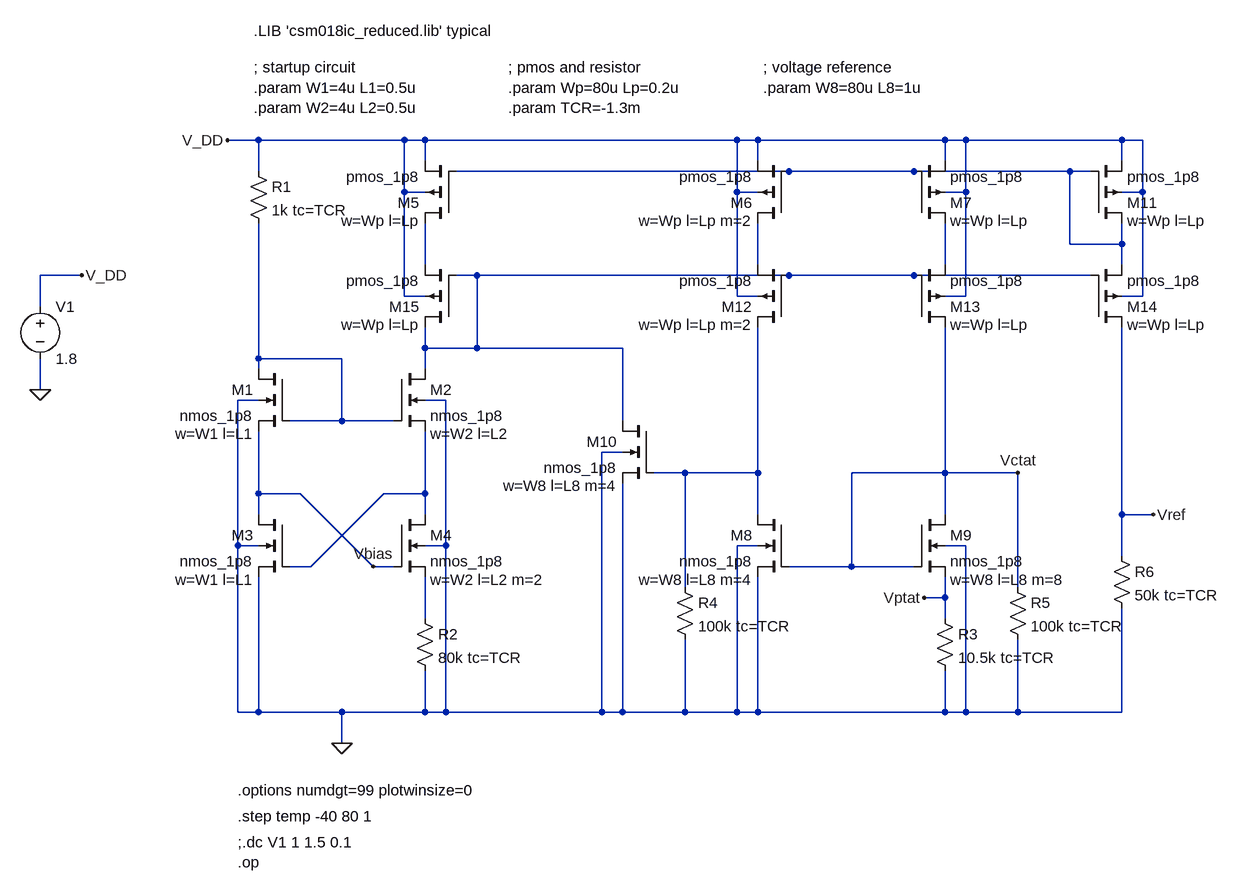
[diagram p0: schematic voltage_ref_cascode.asc]
voltage_ref_cascode.asc, the LTspice schematic file:
Version 4
SHEET 1 2776 948
WIRE 144 -176 96 -176
WIRE 368 -176 144 -176
WIRE 400 -176 368 -176
WIRE 880 -176 400 -176
WIRE 912 -176 880 -176
WIRE 1200 -176 912 -176
WIRE 1232 -176 1200 -176
WIRE 1472 -176 1232 -176
WIRE 1504 -176 1472 -176
WIRE 400 -144 400 -176
WIRE 912 -144 912 -176
WIRE 1200 -144 1200 -176
WIRE 1472 -144 1472 -176
WIRE 144 -128 144 -176
WIRE 960 -128 448 -128
WIRE 1152 -128 960 -128
WIRE 1392 -128 1152 -128
WIRE 1424 -128 1392 -128
WIRE 368 -96 368 -176
WIRE 400 -96 368 -96
WIRE 880 -96 880 -176
WIRE 912 -96 880 -96
WIRE 1232 -96 1232 -176
WIRE 1232 -96 1200 -96
WIRE 1504 -96 1504 -176
WIRE 1504 -96 1472 -96
WIRE 1392 -16 1392 -128
WIRE 1472 -16 1472 -48
WIRE 1472 -16 1392 -16
WIRE 400 16 400 -48
WIRE 912 16 912 -48
WIRE 1200 16 1200 -48
WIRE 1472 16 1472 -16
WIRE -128 32 -192 32
WIRE 480 32 448 32
WIRE 960 32 480 32
WIRE 1152 32 960 32
WIRE 1424 32 1152 32
WIRE 368 64 368 -96
WIRE 400 64 368 64
WIRE 880 64 880 -96
WIRE 912 64 880 64
WIRE 1232 64 1232 -96
WIRE 1232 64 1200 64
WIRE 1504 64 1504 -96
WIRE 1504 64 1472 64
WIRE -192 80 -192 32
WIRE 400 144 400 112
WIRE 480 144 480 32
WIRE 480 144 400 144
WIRE 704 144 480 144
WIRE 144 160 144 -48
WIRE 272 160 144 160
WIRE 144 176 144 160
WIRE 400 176 400 144
WIRE -192 208 -192 160
WIRE 144 224 112 224
WIRE 432 224 400 224
WIRE 272 256 272 160
WIRE 272 256 192 256
WIRE 352 256 272 256
WIRE 704 256 704 144
WIRE 704 304 672 304
WIRE 800 336 752 336
WIRE 912 336 912 112
WIRE 912 336 800 336
WIRE 1200 336 1200 112
WIRE 1200 336 1056 336
WIRE 1312 336 1200 336
WIRE 144 368 144 272
WIRE 208 368 144 368
WIRE 400 368 400 272
WIRE 400 368 336 368
WIRE 144 400 144 368
WIRE 400 400 400 368
WIRE 912 400 912 336
WIRE 1200 400 1200 336
WIRE 1472 400 1472 112
WIRE 1520 400 1472 400
WIRE 112 448 112 224
WIRE 144 448 112 448
WIRE 432 448 432 224
WIRE 432 448 400 448
WIRE 912 448 880 448
WIRE 1232 448 1200 448
WIRE 1472 464 1472 400
WIRE 224 480 336 368
WIRE 224 480 192 480
WIRE 320 480 208 368
WIRE 352 480 320 480
WIRE 1056 480 1056 336
WIRE 1056 480 960 480
WIRE 1152 480 1056 480
WIRE 800 512 800 336
WIRE 1312 512 1312 336
WIRE 1200 528 1200 496
WIRE 1200 528 1168 528
WIRE 400 560 400 496
WIRE 1200 560 1200 528
WIRE 112 704 112 448
WIRE 144 704 144 496
WIRE 144 704 112 704
WIRE 272 704 144 704
WIRE 400 704 400 640
WIRE 400 704 272 704
WIRE 432 704 432 448
WIRE 432 704 400 704
WIRE 672 704 672 304
WIRE 672 704 432 704
WIRE 704 704 704 352
WIRE 704 704 672 704
WIRE 800 704 800 592
WIRE 800 704 704 704
WIRE 880 704 880 448
WIRE 880 704 800 704
WIRE 912 704 912 496
WIRE 912 704 880 704
WIRE 1200 704 1200 640
WIRE 1200 704 912 704
WIRE 1232 704 1232 448
WIRE 1232 704 1200 704
WIRE 1312 704 1312 592
WIRE 1312 704 1232 704
WIRE 1472 704 1472 544
WIRE 1472 704 1312 704
WIRE 272 752 272 704
FLAG 96 -176 V_DD
FLAG -192 208 0
FLAG -128 32 V_DD
FLAG 272 752 0
FLAG 1168 528 Vptat
FLAG 1312 336 Vctat
FLAG 1520 400 Vref
FLAG 320 480 Vbias
SYMBOL nmos4 192 176 M0
WINDOW 123 56 100 Left 2
SYMATTR Value2 w=W1 l=L1
SYMATTR InstName M1
SYMATTR Value nmos_1p8
SYMBOL nmos4 192 400 M0
WINDOW 123 56 100 Left 2
SYMATTR Value2 w=W1 l=L1
SYMATTR InstName M3
SYMATTR Value nmos_1p8
SYMBOL nmos4 352 176 R0
WINDOW 123 56 100 Left 2
SYMATTR Value2 w=W2 l=L2
SYMATTR InstName M2
SYMATTR Value nmos_1p8
SYMBOL nmos4 352 400 R0
WINDOW 123 56 100 Left 2
SYMATTR Value2 w=W2 l=L2 m=2
SYMATTR InstName M4
SYMATTR Value nmos_1p8
SYMBOL res 128 -144 R0
SYMATTR InstName R1
SYMATTR Value 1k tc=TCR
SYMBOL res 384 544 R0
SYMATTR InstName R2
SYMATTR Value 80k tc=TCR
SYMBOL voltage -192 64 R0
WINDOW 123 0 0 Left 0
WINDOW 39 0 0 Left 0
SYMATTR InstName V1
SYMATTR Value 1.8
SYMBOL pmos4 960 -48 R180
WINDOW 123 56 4 Left 2
SYMATTR Value2 w=Wp l=Lp m=2
SYMATTR InstName M6
SYMATTR Value pmos_1p8
SYMBOL pmos4 1152 -48 M180
WINDOW 123 56 4 Left 2
SYMATTR Value2 w=Wp l=Lp
SYMATTR InstName M7
SYMATTR Value pmos_1p8
SYMBOL nmos4 960 400 M0
WINDOW 123 56 100 Left 2
SYMATTR Value2 w=W8 l=L8 m=4
SYMATTR InstName M8
SYMATTR Value nmos_1p8
SYMBOL nmos4 1152 400 R0
WINDOW 123 56 100 Left 2
SYMATTR Value2 w=W8 l=L8 m=8
SYMATTR InstName M9
SYMATTR Value nmos_1p8
SYMBOL nmos4 752 256 M0
WINDOW 123 56 100 Left 2
SYMATTR Value2 w=W8 l=L8 m=4
SYMATTR InstName M10
SYMATTR Value nmos_1p8
SYMBOL res 1184 544 R0
SYMATTR InstName R3
SYMATTR Value 10.5k tc=TCR
SYMBOL res 784 496 R0
SYMATTR InstName R4
SYMATTR Value 100k tc=TCR
SYMBOL res 1296 496 R0
SYMATTR InstName R5
SYMATTR Value 100k tc=TCR
SYMBOL pmos4 448 -48 R180
WINDOW 123 56 4 Left 2
SYMATTR Value2 w=Wp l=Lp
SYMATTR InstName M5
SYMATTR Value pmos_1p8
SYMBOL pmos4 1424 -48 M180
WINDOW 123 56 4 Left 2
SYMATTR Value2 w=Wp l=Lp
SYMATTR InstName M11
SYMATTR Value pmos_1p8
SYMBOL res 1456 448 R0
SYMATTR InstName R6
SYMATTR Value 50k tc=TCR
SYMBOL pmos4 960 112 R180
WINDOW 123 56 4 Left 2
SYMATTR Value2 w=Wp l=Lp m=2
SYMATTR InstName M12
SYMATTR Value pmos_1p8
SYMBOL pmos4 1152 112 M180
WINDOW 123 56 4 Left 2
SYMATTR Value2 w=Wp l=Lp
SYMATTR InstName M13
SYMATTR Value pmos_1p8
SYMBOL pmos4 1424 112 M180
WINDOW 123 56 4 Left 2
SYMATTR Value2 w=Wp l=Lp
SYMATTR InstName M14
SYMATTR Value pmos_1p8
SYMBOL pmos4 448 112 R180
WINDOW 123 56 4 Left 2
SYMATTR Value2 w=Wp l=Lp
SYMATTR InstName M15
SYMATTR Value pmos_1p8
TEXT 136 -344 Left 2 !.LIB 'csm018ic_reduced.lib' typical
TEXT 112 824 Left 2 !.options numdgt=99 plotwinsize=0
TEXT 136 -288 Left 2 !; startup circuit\n.param W1=4u L1=0.5u\n.param W2=4u L2=0.5u
TEXT 112 904 Left 2 !;.dc V1 1 1.5 0.1\n.op
TEXT 112 864 Left 2 !.step temp -40 80 1
TEXT 920 -288 Left 2 !; voltage reference\n.param W8=80u L8=1u
TEXT 528 -288 Left 2 !; pmos and resistor\n.param Wp=80u Lp=0.2u\n.param TCR=-1.3m

The netlist it stands for:
* voltage_ref_cascode.asc
M1 N006 N006 Vbias 0 nmos_1p8 w=W1 l=L1
M3 Vbias N008 0 0 nmos_1p8 w=W1 l=L1
M2 N005 N006 N008 0 nmos_1p8 w=W2 l=L2
M4 N008 Vbias N009 0 nmos_1p8 w=W2 l=L2 m=2
R1 V_DD N006 1k tc=TCR
R2 N009 0 80k tc=TCR
V1 V_DD 0 1.8
M6 N003 N001 V_DD V_DD pmos_1p8 w=Wp l=Lp m=2
M7 N004 N001 V_DD V_DD pmos_1p8 w=Wp l=Lp
M8 N007 Vctat 0 0 nmos_1p8 w=W8 l=L8 m=4
M9 Vctat Vctat Vptat 0 nmos_1p8 w=W8 l=L8 m=8
M10 N005 N007 0 0 nmos_1p8 w=W8 l=L8 m=4
R3 Vptat 0 10.5k tc=TCR
R4 N007 0 100k tc=TCR
R5 Vctat 0 100k tc=TCR
M5 N002 N001 V_DD V_DD pmos_1p8 w=Wp l=Lp
M11 N001 N001 V_DD V_DD pmos_1p8 w=Wp l=Lp
R6 Vref 0 50k tc=TCR
M12 N007 N005 N003 V_DD pmos_1p8 w=Wp l=Lp m=2
M13 Vctat N005 N004 V_DD pmos_1p8 w=Wp l=Lp
M14 Vref N005 N001 V_DD pmos_1p8 w=Wp l=Lp
M15 N005 N005 N002 V_DD pmos_1p8 w=Wp l=Lp
.model NMOS NMOS
.model PMOS PMOS
.lib standard.mos
.LIB 'csm018ic_reduced.lib' typical
.options numdgt=99 plotwinsize=0
; startup circuit
.param W1=4u L1=0.5u
.param W2=4u L2=0.5u
;.dc V1 1 1.5 0.1
.op
.step temp -40 80 1
; voltage reference
.param W8=80u L8=1u
; pmos and resistor
.param Wp=80u Lp=0.2u
.param TCR=-1.3m
.backanno
.end